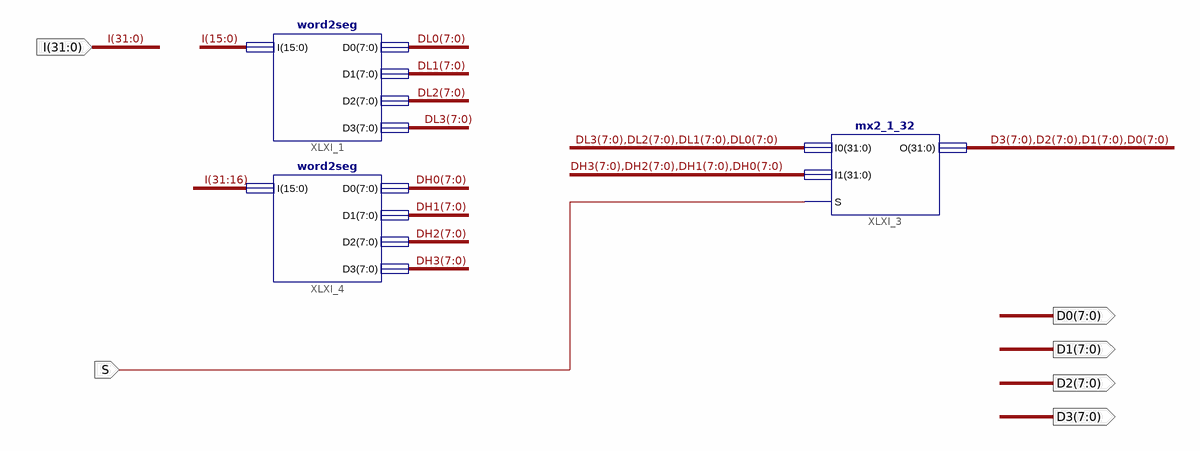
[diagram p0: schematic sheet 1]
// Xilinx ISE schematic dword2seg.sch (spartan3e) as structural Verilog: 3 symbols, 6 ports
module dword2seg (
  input  S,
  input  [31:0] I,
  output [7:0] D0,
  output [7:0] D1,
  output [7:0] D2,
  output [7:0] D3
);

  wire [7:0] DH0, DH1, DH2, DH3, DL0, DL1, DL2, DL3;

  word2seg XLXI_1 (.D0(DL0), .D1(DL1), .D2(DL2), .D3(DL3), .I(I[15:0]));
  mx2_1_32 XLXI_3 (.S(S), .I0({DL3, DL2, DL1, DL0}), .I1({DH3, DH2, DH1, DH0}), .O({D3, D2, D1, D0}));
  word2seg XLXI_4 (.D0(DH0), .D1(DH1), .D2(DH2), .D3(DH3), .I(I[31:16]));
endmodule
